# Altium schematic sheet MCU1.SchDoc: "mahdi"
size A3; Date: 19/6/1400; SheetNumber: 1; SheetTotal: 8
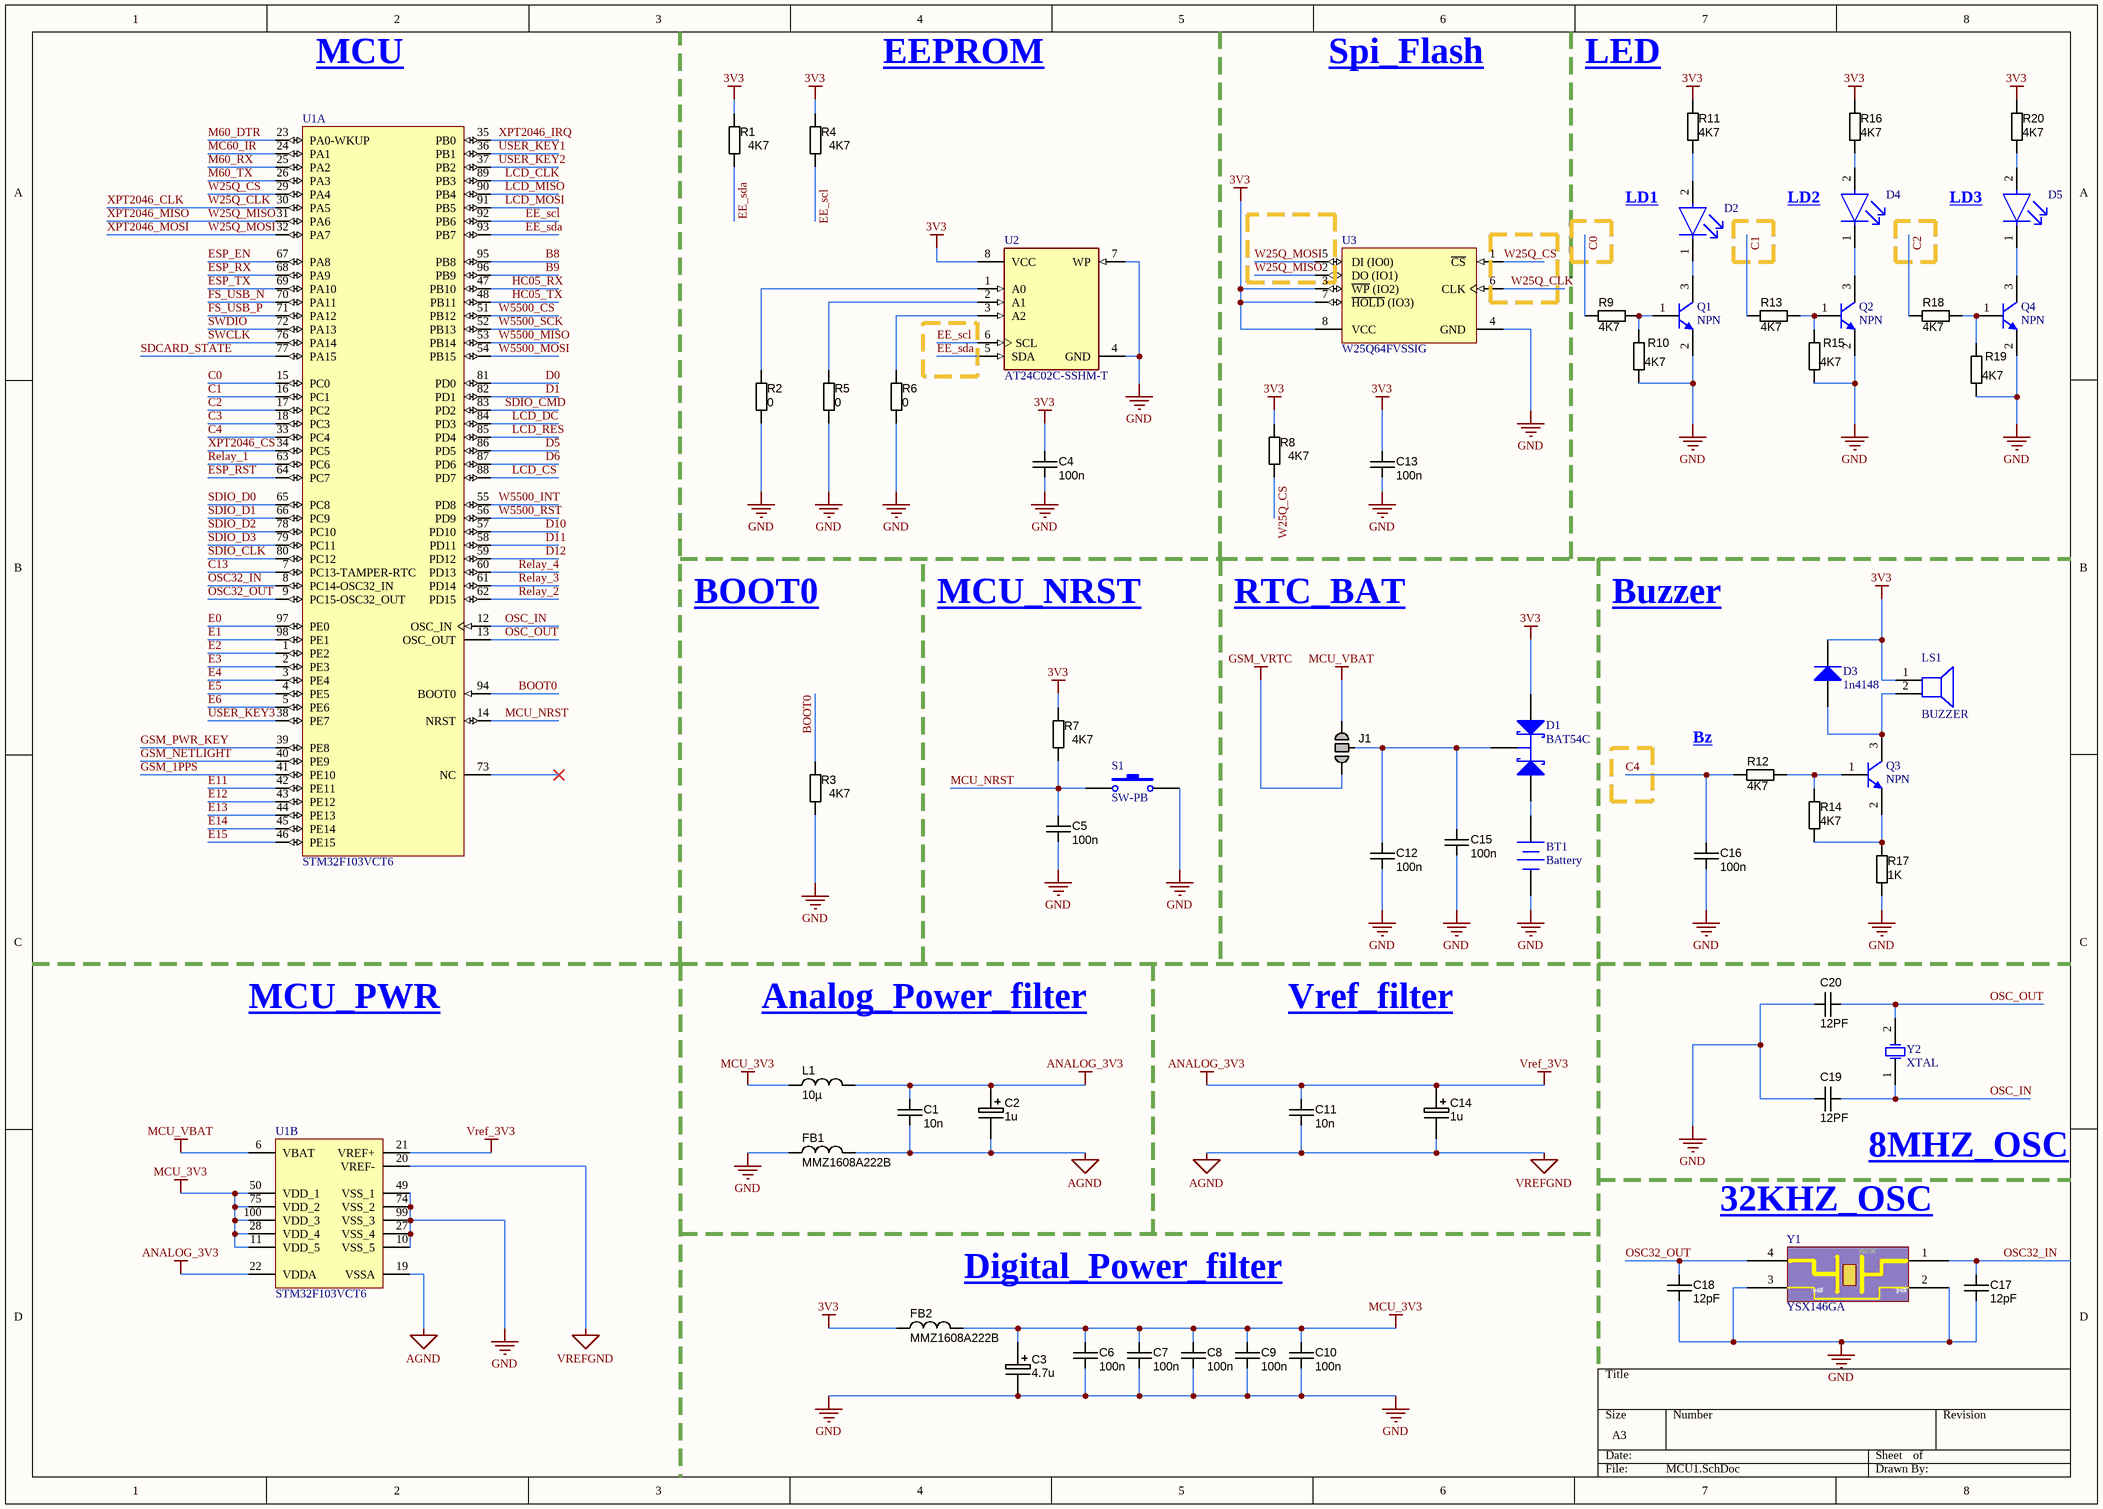
[diagram p0: MCU1.SchDoc]

## Parts
BT1  Battery  [BTH1220]
C1  value 10n  [CAPC1608X90N]  (hidden comment: approved sub OK)
C2  value 1u  [C_TN_3216]
C3  value 4.7u  [C_TN_3528]
C4  value 100n  [CAPC1608X90N]  (hidden comment: approved sub OK)
C5  value 100n  [CAPC1608X90N]  (hidden comment: approved sub OK)
C6  value 100n  [CAPC1608X90N]  (hidden comment: approved sub OK)
C7  value 100n  [CAPC1608X90N]  (hidden comment: approved sub OK)
C8  value 100n  [CAPC1608X90N]  (hidden comment: approved sub OK)
C9  value 100n  [CAPC1608X90N]  (hidden comment: approved sub OK)
C10  value 100n  [CAPC1608X90N]  (hidden comment: approved sub OK)
C11  value 10n  [CAPC1608X90N]  (hidden comment: approved sub OK)
C12  value 100n  [CAPC1608X90N]  (hidden comment: approved sub OK)
C13  value 100n  [CAPC1608X90N]  (hidden comment: approved sub OK)
C14  value 1u  [C_TN_3216]
C15  value 100n  [C1206]  (hidden comment: approved sub OK)
C16  value 100n  [CAPC1608X90N]  (hidden comment: approved sub OK)
C17  value 12pF  [CAPC1608X90N]  (hidden comment: approved sub OK)
C18  value 12pF  [CAPC1608X90N]  (hidden comment: approved sub OK)
C19  value 12PF  [CAPC1608X90N]  (hidden comment: approved sub OK)
C20  value 12PF  [CAPC1608X90N]  (hidden comment: approved sub OK)
D1  BAT54C  [NXP-SOT23-3_V]
D2  LTST-C191TBKT  [FP-LTST-C191TBKT-MFG]  (value not drawn)
D3  1n4148  [d_sod80]
D4  LTST-C191TBKT  [FP-LTST-C191TBKT-MFG]  (value not drawn)
D5  LTST-C191TBKT  [FP-LTST-C191TBKT-MFG]  (value not drawn)
FB1  Manufacturer Part Number 1: MMZ1608A222B  [FBC1608X95N]  (hidden comment: 2K2 @ 100 MHz)
FB2  Manufacturer Part Number 1: MMZ1608A222B  [FBC1608X95N]  (hidden comment: 2K2 @ 100 MHz)
J1  Jumper  [Jump_3Way]  (value not drawn)  (no BOM)
L1  10µ  [INDC3225X250N]
LS1  BUZZER  [BZ_C12]
Q1  NPN  [SOT23-3]
Q2  NPN  [SOT23-3]
Q3  NPN  [SOT23-3]
Q4  NPN  [SOT23-3]
R1  value 4K7  [RESC1608X55N]  (hidden comment: Thick Film)
R2  value 0  [RESC1608X55N]  (hidden comment: Thick Film)
R3  value 4K7  [RESC1608X55N]  (hidden comment: Thick Film)
R4  value 4K7  [RESC1608X55N]  (hidden comment: Thick Film)
R5  value 0  [RESC1608X55N]  (hidden comment: Thick Film)
R6  value 0  [RESC1608X55N]  (hidden comment: Thick Film)
R7  value 4K7  [RESC1608X55N]  (hidden comment: Thick Film)
R8  value 4K7  [RESC1608X55N]  (hidden comment: Thick Film)
R9  value 4K7  [RESC1608X55N]  (hidden comment: Thick Film)
R10  value 4K7  [RESC1608X55N]  (hidden comment: Thick Film)
R11  value 4K7  [RESC1608X55N]  (hidden comment: Thick Film)
R12  value 4K7  [RESC1608X55N]  (hidden comment: Thick Film)
R13  value 4K7  [RESC1608X55N]  (hidden comment: Thick Film)
R14  value 4K7  [RESC1608X55N]  (hidden comment: Thick Film)
R15  value 4K7  [RESC1608X55N]  (hidden comment: Thick Film)
R16  value 4K7  [RESC1608X55N]  (hidden comment: Thick Film)
R17  value 1K  [RESC1608X55N]  (hidden comment: Thick Film)
R18  value 4K7  [RESC1608X55N]  (hidden comment: Thick Film)
R19  value 4K7  [RESC1608X55N]  (hidden comment: Thick Film)
R20  value 4K7  [RESC1608X55N]  (hidden comment: Thick Film)
S1  SW-PB  [SWPBS_SPST_6X3X5]
U1  STM32F103VCT6  [STM-LQFP100_L]  (parts A,B of 2)
U2  AT24C02C-SSHM-T  [FP-C04-057-SN-MFG]
U3  W25Q64FVSSIG  [WINB-SOIC-8_M]
Y1  YSX146GA  [YSX146GA-32.768xTAL]
Y2  XTAL  [XTL_2_5032]

## Nets
3V3: C4.1 C13.1 D1.2(A) D3.2(K) FB2.1 LS1.1 R1.1 R4.1 R7.1 R8.1 R11.2 R16.2 R20.2 U2.8(VCC) U3.3(~{WP}_(IO2)) U3.7(~{HOLD}_(IO3)) U3.8(VCC)
AGND: C1.2 C2.2 C11.2 C14.2 FB1.2 U1.19(VSSA) U1.20(VREF-)  [also labelled VREFGND]
ANALOG_3V3: C1.1 C2.1 C11.1 C14.1 L1.2 U1.21(VREF+) U1.22(VDDA)  [also labelled Vref_3V3]
GND: BT1.2(-) C3.2 C4.2 C5.2 C6.2 C7.2 C8.2 C9.2 C10.2 C12.2 C13.2 C15.2 C16.2 C17.1 C18.1 C19.1 C20.1 FB1.1 Q1.2(E) Q2.2(E) Q4.2(E) R2.1 R3.2 R5.1 R6.1 R10.1 R15.1 R17.2 R19.1 S1.2 U1.10(VSS_5) U1.27(VSS_4) U1.49(VSS_1) U1.74(VSS_2) U1.99(VSS_3) U2.4(GND) U2.7(WP) U3.4(GND) Y1.2 Y1.3
GSM_VRTC: J1.1
MCU_3V3: C3.1 C6.1 C7.1 C8.1 C9.1 C10.1 FB2.2 L1.1 U1.11(VDD_5) U1.28(VDD_4) U1.50(VDD_1) U1.75(VDD_2) U1.100(VDD_3)
MCU_VBAT: J1.3 U1.6(VBAT)
B8: U1.95(PB8)
B9: U1.96(PB9)
BOOT0: R3.1 U1.94(BOOT0)
C0: R9.1 U1.15(PC0)
C1: R13.1 U1.16(PC1)
C2: R18.1 U1.17(PC2)
C3: U1.18(PC3)
C4: C16.1 R12.1 U1.33(PC4)
C13: U1.7(PC13-TAMPER-RTC)
D0: U1.81(PD0)
D1: U1.82(PD1)
D5: U1.86(PD5)
D6: U1.87(PD6)
D10: U1.57(PD10)
D11: U1.58(PD11)
D12: U1.59(PD12)
E0: U1.97(PE0)
E1: U1.98(PE1)
E2: U1.1(PE2)
E3: U1.2(PE3)
E4: U1.3(PE4)
E5: U1.4(PE5)
E6: U1.5(PE6)
E11: U1.42(PE11)
E12: U1.43(PE12)
E13: U1.44(PE13)
E14: U1.45(PE14)
E15: U1.46(PE15)
EE_scl: R4.2 U1.92(PB6) U2.6(SCL)
EE_sda: R1.2 U1.93(PB7) U2.5(SDA)
ESP_EN: U1.67(PA8)
ESP_RST: U1.64(PC7)
ESP_RX: U1.68(PA9)
ESP_TX: U1.69(PA10)
FS_USB_N: U1.70(PA11)
FS_USB_P: U1.71(PA12)
GSM_1PPS: U1.41(PE10)
GSM_NETLIGHT: U1.40(PE9)
GSM_PWR_KEY: U1.39(PE8)
HC05_RX: U1.47(PB10)
HC05_TX: U1.48(PB11)
LCD_CLK: U1.89(PB3)
LCD_CS: U1.88(PD7)
LCD_DC: U1.84(PD3)
LCD_MISO: U1.90(PB4)
LCD_MOSI: U1.91(PB5)
LCD_RES: U1.85(PD4)
M60_DTR: U1.23(PA0-WKUP)
M60_RX: U1.25(PA2)
M60_TX: U1.26(PA3)
MC60_IR: U1.24(PA1)
MCU_NRST: C5.1 R7.2 S1.1 U1.14(NRST)
OSC32_IN: C17.2 U1.8(PC14-OSC32_IN) Y1.1
OSC32_OUT: C18.2 U1.9(PC15-OSC32_OUT) Y1.4
OSC_IN: C19.2 U1.12(OSC_IN) Y2.1(OSC1)
OSC_OUT: C20.2 U1.13(OSC_OUT) Y2.2(OSC2)
Relay_1: U1.63(PC6)
Relay_2: U1.62(PD15)
Relay_3: U1.61(PD14)
Relay_4: U1.60(PD13)
SDCARD_STATE: U1.77(PA15)
SDIO_CLK: U1.80(PC12)
SDIO_CMD: U1.83(PD2)
SDIO_D0: U1.65(PC8)
SDIO_D1: U1.66(PC9)
SDIO_D2: U1.78(PC10)
SDIO_D3: U1.79(PC11)
SWCLK: U1.76(PA14)
SWDIO: U1.72(PA13)
USER_KEY1: U1.36(PB1)
USER_KEY2: U1.37(PB2)
USER_KEY3: U1.38(PE7)
W25Q_CLK: U1.30(PA5) U3.6(CLK)  [also labelled XPT2046_CLK]
W25Q_CS: R8.2 U1.29(PA4) U3.1(~{CS})
W25Q_MISO: U1.31(PA6) U3.2(DO_(IO1))  [also labelled XPT2046_MISO]
W25Q_MOSI: U1.32(PA7) U3.5(DI_(IO0))  [also labelled XPT2046_MOSI]
W5500_CS: U1.51(PB12)
W5500_INT: U1.55(PD8)
W5500_MISO: U1.53(PB14)
W5500_MOSI: U1.54(PB15)
W5500_RST: U1.56(PD9)
W5500_SCK: U1.52(PB13)
XPT2046_CS: U1.34(PC5)
XPT2046_IRQ: U1.35(PB0)
NetBT1_1: BT1.1(+) D1.1(A)
NetC12_1: C12.1 C15.1 D1.3(K) J1.2
NetD2_1: D2.1(C) Q1.3(C)
NetD2_2: D2.2(A) R11.1
NetD3_1: D3.1(A) LS1.2 Q3.3(C)
NetD4_1: D4.1(C) Q2.3(C)
NetD4_2: D4.2(A) R16.1
NetD5_1: D5.1(C) Q4.3(C)
NetD5_2: D5.2(A) R20.1
NetQ1_1: Q1.1(B) R9.2 R10.2
NetQ2_1: Q2.1(B) R13.2 R15.2
NetQ3_1: Q3.1(B) R12.2 R14.2
NetQ3_2: Q3.2(E) R14.1 R17.1
NetQ4_1: Q4.1(B) R18.2 R19.2
NetR2_2: R2.2 U2.1(A0)
NetR5_2: R5.2 U2.2(A1)
NetR6_2: R6.2 U2.3(A2)

Not connected (* = marked no-connect by the designer): U1 73(NC)*

## Notes on the sheet
- MCU
- EEPROM
- Spi_Flash
- LED
- LD1
- LD2
- LD3
- BOOT0
- MCU_NRST
- RTC_BAT
- Buzzer
- (near R12) Bz
- MCU_PWR
- Analog_Power_filter
- Vref_filter
- 8MHZ_OSC
- (near Y1) 32KHZ_OSC
- Digital_Power_filter
- (in symbol YSX146GA) 32.768; gnd

## Library data of the parts
BT1 = Battery: Multicell Battery; Published: 24-Mar-1999; LatestRevisionDate: 17-Jul-2002; LatestRevisionNote: Re-released for DXP Platform.; PackageReference: BAT-2; Publisher: Altium Limited; PackageDescription: Battery; 2 Leads
C1 C4-C13 C15 C16 = CAPC_100n_0603_X7R_50V_10%: Capacitor SMD Cer 100nF 10% 50V X7R 0603; Manufacturer 1: AVX Corporation; Manufacturer Part Number 1: 06035C104KAT2A; Ratings: 50V; X7R; Material: ceramic; SCDType: spec; Manufacturer 2: TDK Corporation; Manufacturer Part Number 2: C1608X7R1H104K; Package / Case: 0603 (1608 Metric); Tolerance: ±10%; Supplier 1: Digi-Key; Supplier Part Number 1: 478-5052-1-ND; ComponentLink1URL: http://www.avx.com/docs/Catalogs/cx7r.pdf; ComponentLink1Description: http://www.avx.com/docs/Catalogs/cx7r.pdf; Supplier 2: Digi-Key; Supplier Part Number 2: 445-1314-1-ND; ComponentLink2URL: http://product.tdk.com/capacitor/mlcc/en/documents/mlcc_commercial_general_en.pdf; ComponentLink2Description: http://product.tdk.com/capacitor/mlcc/en/documents/mlcc_commercial_general_en.pdf
C2 C3 C14 = CAPT_4u7_3216_16V: Capacitor SMD Tantalum 10uF 10% 16V 3216-18; Manufacturer 1: Vishay/Sprague; Manufacturer Part Number 1: 293D475X9016A2TE3; SCDType: undef; Package / Case: EIA 535BAAC size A; Ratings: 16V; Tolerance: ±10%; Material: Tantalum; Supplier 1: Digi-Key; Supplier Part Number 1: 718-1148-1-ND
C17 C18 = CAPC_100n_0603_X7R_50V_10%: Capacitor SMD Cer 6.8PF 10% 50V X7R 0603; Manufacturer 1: AVX Corporation; Manufacturer Part Number 1: 06035C104KAT2A; Ratings: 50V; X7R; Material: ceramic; SCDType: spec; Manufacturer 2: TDK Corporation; Manufacturer Part Number 2: C1608X7R1H104K; Package / Case: 0603 (1608 Metric); Tolerance: ±10%; Supplier 1: Digi-Key; Supplier Part Number 1: 478-5052-1-ND; ComponentLink1URL: http://www.avx.com/docs/Catalogs/cx7r.pdf; ComponentLink1Description: http://www.avx.com/docs/Catalogs/cx7r.pdf; Supplier 2: Digi-Key; Supplier Part Number 2: 445-1314-1-ND; ComponentLink2URL: http://product.tdk.com/capacitor/mlcc/en/documents/mlcc_commercial_general_en.pdf; ComponentLink2Description: http://product.tdk.com/capacitor/mlcc/en/documents/mlcc_commercial_general_en.pdf
C19 C20 = CAPC_100n_0603_X7R_50V_10%: Capacitor SMD Cer 20PF10% 50V X7R 0603; Manufacturer 1: AVX Corporation; Manufacturer Part Number 1: 06035C104KAT2A; Tolerance: ±10%; Ratings: 50V; X7R; Material: ceramic; SCDType: spec; Manufacturer 2: TDK Corporation; Manufacturer Part Number 2: C1608X7R1H104K; Package / Case: 0603 (1608 Metric); Supplier 1: Digi-Key; Supplier Part Number 1: 478-5052-1-ND; ComponentLink1URL: http://www.avx.com/docs/Catalogs/cx7r.pdf; ComponentLink1Description: http://www.avx.com/docs/Catalogs/cx7r.pdf; Supplier 2: Digi-Key; Supplier Part Number 2: 445-1314-1-ND; ComponentLink2URL: http://product.tdk.com/capacitor/mlcc/en/documents/mlcc_commercial_general_en.pdf; ComponentLink2Description: http://product.tdk.com/capacitor/mlcc/en/documents/mlcc_commercial_general_en.pdf
D1 = CMP-0417-00003-1: Schottky Barrier Diode, 30 V, 2 uA, -55 to 150 degC, 3-Pin SOT23, RoHS, Tape and Reel; Manufacturer: NXP Semiconductors; IR (uA): 2; VF (mV): 800; Trr (ns): 5; Cd (pF): 10; VR (V): 30; Rth(j-a) (K/W): 500; RoHS: TRUE; Packing: Tape and Reel; ComponentLink2URL: http://www.nxp.com/documents/data_sheet/BAT54_SER.pdf; PartNumber: BAT54C; ComponentLink2Description: Datasheet; Temperature Range: -55 to 150 degC; PackageReference: SOT23-3; PackageDescription: 3-Pin Plastic Surface-mounted Package, Body 1.3 x 2.9 mm, Pitch 0.95 mm; Mounting Technology: Surface Mount; ComponentLink1URL: http://www.nxp.com/; DatasheetVersion: Rev. 5; ComponentLink1Description: Manufacturer URL
D2 D4 D5 = CMP-22017-000008-1: LED BLUE CLEAR CHIP SMD; Lens Color: Colorless; Dominant Wavelength: 475nm; Forward Current: 20mA; Wavelength: 468nm; Viewing Angle: 130°; Power Dissipation: 76mW; Luminous Intensity: 180mcd; Reverse Voltage: 5V; Number of Elements: 1; Lens Style: Diffused; Forward Voltage: 3.8V; Max Power Dissipation: 75mW; Case Code (Metric): 1608; Packaging: Tape and Reel; Case/Package: 0603; Depth: 1.6mm; Mount: Surface Mount; Lead Free: Lead Free; Min Operating Temperature: -20°C; Lens Transparency: Clear; Illumination Color: Blue; Height: 0.55mm; Test Current: 20mA; Case Code (Imperial): 0603; Max Operating Temperature: 80°C; Number of Pins: 2; Length: 0.8mm; Radiation Hardening: No; Package Quantity: 1; Number of LEDs: 1; Width: 0.8mm; Color: Blue
D3 = Diode: Default Diode; Published: 8-Jun-2000; LatestRevisionDate: 17-Jul-2002; LatestRevisionNote: Re-released for DXP Platform.; PackageVersion: Sep-1996; PackageReference: SMC; Publisher: Altium Limited; PackageDescription: DO-214-AB/SMC; 2 C-Bend Leads; Body 7.9 x 5.9 mm, inc. leads (LxW); Code_JEDEC: DO-214-AB
FB1 FB2 = FERRITE_2K2-100MHz_0603: Ferrite bead 2.2K Ohm at 100 MHz 200mA 0603 SMD; Manufacturer 1: TDK Corporation; Ratings: 200 mA; 800 mOhm DC; Impedance @ Frequency: 2200 Ohm @ 100MHz; DC Resistance (DCR): 800 mOhm Max; Filter Type: Differential Mode - Single; SCDType: source; Size / Dimension: 0.063" L x 0.031" W (1.60mm x 0.80mm); Current Rating: 200mA; Package / Case: 0603 (1608 Metric); Height (Max): 0.037" (0.95mm); Mounting Type: Surface Mount; Supplier 1: Digi-Key; Supplier Part Number 1: 445-8671-1-ND; RoHS 1: RoHS Compliant; ComponentLink1URL: http://www.tdk.co.jp/tefe02/e9412_mmz.pdf; ComponentLink1Description: http://www.tdk.co.jp/tefe02/e9412_mmz.pdf; Value: 2K2 @ 100 MHz
J1 = JUMP_3WAY: SMD jumper
L1 = INDC_10u_LowRDC: Inductor SMD Low DCR 10 µH 900mA 20% 1210; Manufacturer 1: Taiyo Yuden; Manufacturer Part Number 1: CBC3225T100MR; Ratings: 900 mA; 133 mOhm; DC Resistance (DCR): 172.9 mOhm Max; Frequency - Self Resonant: 23MHz; Frequency - Test: 100kHz; SCDType: spec; Tolerance: ±20%; Supplier 1: Digi-Key; Supplier Part Number 1: 587-1625-1-ND; Current: 900mA; Current - Saturation: 900mA; Current - Temperature Rise: 900mA; Applications: Power Supplies; Package / Case: 1210 (3225 Metric); Operating Temperature: -40°C ~ 105°C; ComponentLink1URL: http://www.yuden.co.jp/ut/product/pdf/wound02_e.pdf; ComponentLink1Description: http://www.yuden.co.jp/ut/product/pdf/wound02_e.pdf; Value: 10µ
LS1 = Speaker: Loudspeaker; Published: 24-Mar-1999; LatestRevisionDate: 17-Jul-2002; LatestRevisionNote: Re-released for DXP Platform.; PackageReference: PIN2; Publisher: Altium Limited
Q1-Q4 = NPN: NPN Bipolar Transistor; Published: 8-Jun-2000; LatestRevisionDate: 17-Jul-2002; LatestRevisionNote: Re-released for DXP Platform.; PackageReference: TO-226-AA; Publisher: Altium Limited; PackageDescription: TO, Flat Index; 3 In-Line, Axial Leads; Body Dia. 4.8mm; Leads 0.55 x 0.51 mm (max); Code_JEDEC: TO-226-AA
R1 R3 R4 R7-R20 = RES_4K7_0603_5%: Resistor SMD chip 4.7k Ohm 0.1W 5% 0603; Manufacturer 1: Vishay/Dale; Manufacturer Part Number 1: CRCW06034K70JNEA; Ratings: 1/10 W; SCDType: spec; Package / Case: 0603 (1608 metric); Tolerance: ±5%; Material: Thick Film; Supplier 1: Digi-Key; Supplier Part Number 1: 541-4.7KGCT-ND
R2 R5 R6 = RES_4K7_0603_5%: Resistor SMD chip 0 Ohm 0.1W 5% 0603; Manufacturer 1: Vishay/Dale; Manufacturer Part Number 1: CRCW06034K70JNEA; Ratings: 1/10 W; SCDType: spec; Package / Case: 0603 (1608 metric); Tolerance: ±5%; Material: Thick Film; Supplier 1: Digi-Key; Supplier Part Number 1: 541-4.7KGCT-ND
S1 = SW-PB: Switch; Published: 24-Mar-1999; LatestRevisionDate: 17-Jul-2002; LatestRevisionNote: Re-released for DXP Platform.; PackageReference: SPST-2; Publisher: Altium Limited; PackageDescription: Switch; 2 Leads
U1 = CMP-0237-00164-3: ARM Cortex-M3 32-bit MCU, 256 KB Flash, 48 KB Internal RAM, 80 I/Os, 100-pin LQFP, -40 to 85 degC, Tray; FLASH Size (Prog) (kB): 256; I/Os (High Current): 80; Supply Voltage(Vcc) min (V): 2; Operating Frequency(F) (Processor speed) (MHz): 72; Internal RAM Size (kB): 48; A/D Converter: 3x12-bit (16 Channel); D/A Converter: 2x12-bit (2 Channel); PartNumber: STM32F103VCT6; ComponentLink2URL: http://www.st.com/st-web-ui/static/active/en/resource/technical/document/datasheet/CD00191185.pdf; Packing: Tray; ComponentLink3Description: Package Specification; PackageReference: LQFP100; ComponentLink1Description: Manufacturer URL; ComponentLink2Description: Datasheet; PackageDescription: 100-Pin Low Profile Quad Flat Package, 14 x 14 mm Body, 0.5 mm Pitch; DatasheetVersion: Rev. 8; Core: ARM Cortex-M3; ComponentLink1URL: http://www.st.com/web/en/home.html; ComponentLink3URL: http://www.st.com/st-web-ui/static/active/en/resource/technical/document/data_brief/DM00071938.pdf; Mounting Technology: Surface Mount; PackageVersion: Rev. 1, 06/2013
U2 = CMP-06313-000008-1: IC EEPROM 2K I2C 1MHZ 8SOIC; Manufacturer: Microchip; Frequency: 1000kHz; Nominal Supply Current: 0.4-2mA; Min Supply Voltage: 1.7V; Standoff Height: 0.1mm; Access Time: 900ns; Memory Size: 2Kbits; Max Supply Voltage: 5.5V; Interface: I2C,2-Wire; Ipc Land Pattern Name: SOIC127P600X175-8; Octopart: https://octopart.com/at24c02c-sshm-t-microchip-77757935; Footprint Url: http://ww1.microchip.com/downloads/en/DeviceDoc/08L_SOIC_150_3dot9mm_SN_C04-00057e.pdf; Temperature Range High: +85°C; Height: 1.75mm; Package: C04-057-SN; RoHS: TRUE; Mouser Description: EEPROM Serial-2Wire 2K-bit 256 x 8 1.8V/2.5V/3.3V/5V Automotive 8-Pin SOIC T/R; Memory Type: EEPROM; Device Class L3: EEPROM; Device Class L2: Memory; ComponentLink2URL: http://ww1.microchip.com/downloads/en/DeviceDoc/AT24C01C-AT24C02C-I2C-Compatible-Two-Wire-Serial-EEPROM-1Kbit-2Kbit-20006111A.pdf; Digikey Description: IC EEPROM 2K I2C 1MHZ 8SOIC; Category: IC; Temperature: -40°C to +85°C; Lead Free: Yes; Manufacturer Part Number: AT24C02C-SSHM-T; ComponentLink2Description: Datasheet; Temperature Range Low: -40°C; Automotive: No; Device Class L1: Integrated Circuits (ICs)
U3 = CMP-2000-05007-1: 3V 64M-Bit Serial Flash Memory with Dual/Quad SPI & QPI, 2.7 to 3.6 V, -40 to 85 degC, 8-Pin SOIC, RoHS, Tape and Reel; Manufacturer: Winbond; Boot Type: Bottom/Top; Word Size: 8b; Cell Type: NOR; Operating Supply Voltage (Min): 2.7V; Operating Supply Voltage (Max): 3.6V; Rad Hardened: No; Density: 67108864Bit; Address Bus: 1b; Supply Current: 40mA; Sync/Async: Synchronous; Number of Words: 8M; Programmable: Yes; Operating Supply Voltage (Typ): 3/3.3V; Access Time (Max): 8.5ns; Interface Type: Serial(SPI); Operating Temperature Classification: Industrial; Datasheet Version: Rev. D, 12/2011; Operating Temp Range: -40Cto85C; Operating Temperature (Max): 85C; Pin Count: 8; Mounting: SurfaceMount; Program/Erase Volt (Typ): 2.7to3.6V; Operating Temperature (Min): -40C; Package Description: 8-Pin Small Outline Integrated Circuit, Body 5.28 x 5.28 mm, Pitch 1.27 mm; Datasheet URL: https://datasheet.ciiva.com/15126/getdatasheetpartid-552937-15126648.pdf; Package Reference: SS-8; Manufacturer URL: http://www.winbond.com/hq/index.html?__locale=en; Package Type: SOIC
Y2 = XTAL: Crystal Oscillator; Published: 8-Jun-2000; LatestRevisionDate: 17-Jul-2002; LatestRevisionNote: Re-released for DXP Platform.; PackageReference: R38; Publisher: Altium Limited; PackageDescription: Crystal, Thru-Hole; 2 Leads; Body 3.1 x 8.2 mm (Dia.xH)